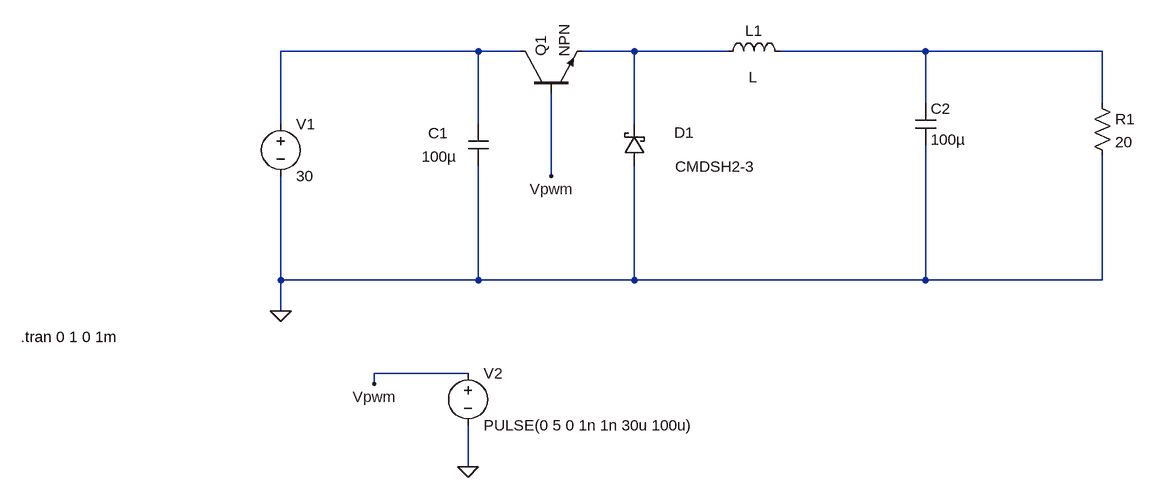
[diagram p0: schematic Draft1.asc]
Draft1.asc, the LTspice schematic file:
Version 4.1
SHEET 1 1520 680
WIRE 400 0 96 0
WIRE 464 0 400 0
WIRE 640 0 560 0
WIRE 784 0 640 0
WIRE 1088 0 864 0
WIRE 1360 0 1088 0
WIRE 1088 80 1088 0
WIRE 1360 80 1360 0
WIRE 96 112 96 0
WIRE 400 112 400 0
WIRE 640 112 640 0
WIRE 512 192 512 64
WIRE 96 352 96 192
WIRE 400 352 400 176
WIRE 400 352 96 352
WIRE 640 352 640 176
WIRE 640 352 400 352
WIRE 1088 352 1088 144
WIRE 1088 352 640 352
WIRE 1360 352 1360 160
WIRE 1360 352 1088 352
WIRE 96 400 96 352
WIRE 384 496 240 496
WIRE 240 512 240 496
WIRE 384 640 384 576
FLAG 96 400 0
FLAG 384 640 0
FLAG 240 512 Vpwm
FLAG 512 192 Vpwm
SYMBOL voltage 96 96 R0
WINDOW 123 0 0 Left 0
WINDOW 39 0 0 Left 0
SYMATTR InstName V1
SYMATTR Value 30
SYMBOL cap 384 112 R0
WINDOW 0 -61 14 Left 2
WINDOW 3 -71 50 Left 2
SYMATTR InstName C1
SYMATTR Value 100µ
SYMBOL ind 768 16 R270
WINDOW 0 32 56 VTop 2
WINDOW 3 -8 55 VBottom 2
SYMATTR InstName L1
SYMBOL res 1344 64 R0
SYMATTR InstName R1
SYMATTR Value 20
SYMBOL cap 1072 80 R0
SYMATTR InstName C2
SYMATTR Value 100µ
SYMBOL schottky 656 176 R180
WINDOW 0 -76 51 Left 2
WINDOW 3 -170 -1 Left 2
SYMATTR InstName D1
SYMATTR Value CMDSH2-3
SYMBOL npn 464 64 R270
SYMATTR InstName Q1
SYMBOL voltage 384 480 R0
SYMATTR InstName V2
SYMATTR Value PULSE(0 5 0 1n 1n 30u 100u)
TEXT -304 440 Left 2 !.tran 0 1 0 1m

The netlist it stands for:
* Draft1.asc
V1 N001 0 30
C1 N001 0 100µ
L1 N002 N003 L
R1 N003 0 20
C2 N003 0 100µ
D1 0 N002 CMDSH2-3
Q1 N001 Vpwm N002 0 NPN
V2 Vpwm 0 PULSE(0 5 0 1n 1n 30u 100u)
.model D D
.lib standard.dio
.model NPN NPN
.model PNP PNP
.lib standard.bjt
.tran 0 1 0 1m
.backanno
.end